# EAGLE schematic PCB_2.1 (EAGLE 8.6.3)
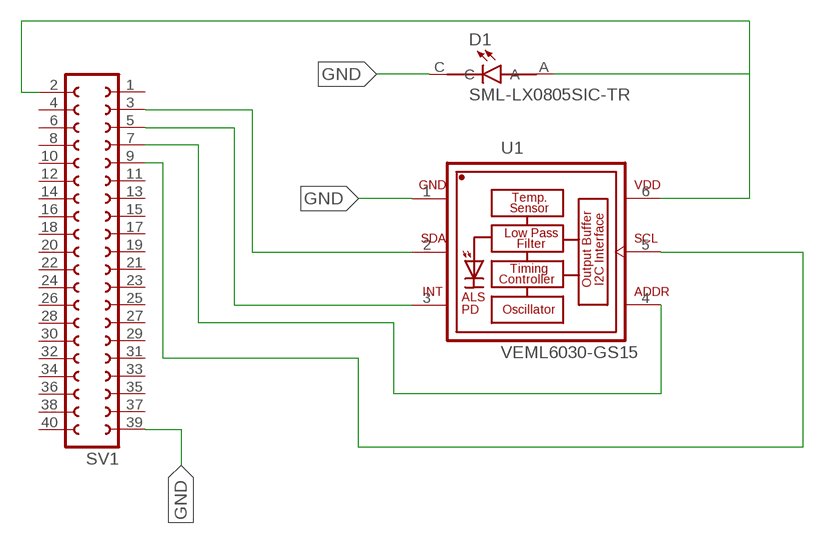
[diagram p0: schematic, sheet 1]

## Parts
D1  SML-LX0805SIC-TR  [LEDC2012X120N]
SV1  FE20-2  [FE20-2]
U1  VEML6030-GS15  [VISHAY_VEML6030_2X2X0.87]

## Nets
GND: D1.C SV1.39 U1.1(GND)
N$2: SV1.3 U1.2(SDA)
N$3: SV1.5 U1.3(INT)
N$4: SV1.9 U1.5(SCL)
N$5: SV1.7 U1.4(ADDR)
VCCB: D1.A SV1.2 U1.6(VDD)
Unconnected: SV1.1 SV1.4 SV1.6 SV1.8 SV1.10 SV1.11 SV1.12 SV1.13 SV1.14 SV1.15 SV1.16 SV1.17 SV1.18 SV1.19 SV1.20 SV1.21 SV1.22 SV1.23 SV1.24 SV1.25 SV1.26 SV1.27 SV1.28 SV1.29 SV1.30 SV1.31 SV1.32 SV1.33 SV1.34 SV1.35 SV1.36 SV1.37 SV1.38 SV1.40

## Library data of the parts
D1 = SML-LX0805SIC-TR:SML-LX0805SIC-TR: LED, RED, 1.25MM X 1.4MM, 60MCD, 636NM; AVAILABILITY: Unavailable; DESCRIPTION: Super Red 2 x 1.25 mm 0805 140° Water Clear 60 mcd 2 V PCB Surface Mount LED; MF: Lumex Opto/Components; MP: SML-LX0805SIC-TR; PACKAGE: 0805 Lumex; PRICE: None
SV1 = con-lsta:FE20-2: FEMALE HEADER; OC_FARNELL: unknown; OC_NEWARK: unknown
U1 = VEML6030-GS15:VEML6030-GS15: VEML6030 High Accuracy Ambient Light Sensor with I2C Interface: VEML6030 is a high accuracy ambient light digital 16-bit resolution sensor in a miniature transparent 2 mm x 2 mm package. It includes a high sensitive photodiode, a low noise amplifier, a 16-bit A/D converter and supports an easy to use I2C bus communication interface and additional interrupt feature. The ambient light result is as digital value available. Device Model created 15.06.2016 by Johannes Kolb - Vishay Semiconductor GmbH; AVAILABILITY: Unavailable; DESCRIPTION: High Accuracy Ambient Light Sensor With I2c Interface; MF: Vishay Semiconductor; MP: VEML6030-GS15; PACKAGE: SMD-6 Vishay Semiconductor; PRICE: None

## Module BUZZER
Ports: 

### Library data of the parts